# EAGLE design lanternLED (EAGLE 8.6.3)
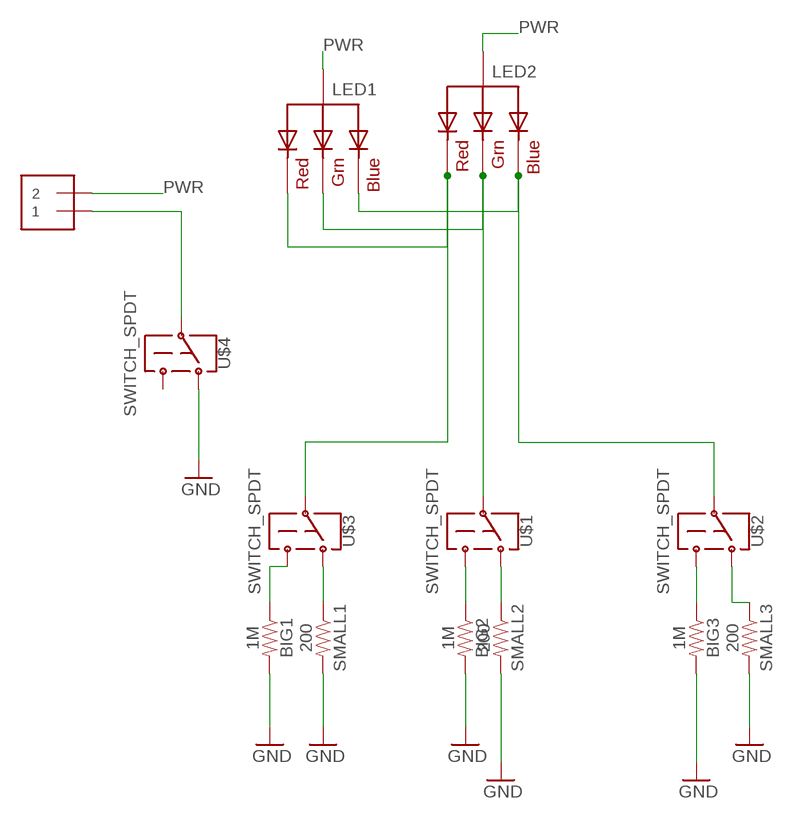
[diagram p0: schematic, sheet 1]

## Parts
BIG1  1M  10KOHM-0603-1/10W-1%  [0603]
BIG2  1M  10KOHM-0603-1/10W-1%  [0603]
BIG3  1M  10KOHM-0603-1/10W-1%  [0603]
J1  1X2BIGGERHOLES  [1X2-4.5MM]
LED1  RGBLED_CA-PIRANHA  [PIRANHA5MM]
LED2  RGBLED_CA-PIRANHA  [PIRANHA5MM]
SMALL1  200  4.7KOHM-0603-1/10W-1%  [0603]
SMALL2  200  4.7KOHM-0603-1/10W-1%  [0603]
SMALL3  200  4.7KOHM-0603-1/10W-1%  [0603]
U$1  SWITCH_SPDT  [SWITCH_SPDT_SMD_CLSB12B]
U$2  SWITCH_SPDT  [SWITCH_SPDT_SMD_CLSB12B]
U$3  SWITCH_SPDT  [SWITCH_SPDT_SMD_CLSB12B]
U$4  SWITCH_SPDT  [SWITCH_SPDT_SMD_CLSB12B]

## Nets
GND: BIG1.2 BIG2.2 BIG3.2 SMALL1.2 SMALL2.2 SMALL3.2 U$4.SIDER
N$1: LED1.2(RED) LED2.2(RED) U$3.TOP(SINGLE)
N$2: LED1.3(GREEN) LED2.3(GREEN) U$1.TOP(SINGLE)
N$3: LED1.1(BLUE) LED2.1(BLUE) U$2.TOP(SINGLE)
N$4: BIG1.1 U$3.SIDEL
N$5: SMALL1.1 U$3.SIDER
N$6: BIG2.1 U$1.SIDEL
N$7: SMALL2.1 U$1.SIDER
N$8: BIG3.1 U$2.SIDEL
N$9: SMALL3.1 U$2.SIDER
N$11: J1.1 U$4.TOP(SINGLE)
PWR: J1.2 LED1.4(VCC) LED2.4(VCC)
Unconnected: U$4.SIDEL

## Library data of the parts
BIG1-BIG3 = SparkFun-Resistors:10KOHM: 10kΩ resistor A resistor is a passive two-terminal electrical component that implements electrical resistance as a circuit element. Resistors act to reduce current flow, and, at the same time, act to lower voltage levels within circuits. - Wikipedia; PROD_ID: RES-00824; VALUE: 10k
J1 = adafruit:1X2: 3.5mm Terminal block http://www.ladyada.net/library/pcb/eaglelibrary.html
LED1 LED2 = adafruit:RGBLED_CA: RGB LED, common-anode 5MM Staggered pins 5mm Piranha package http://www.ladyada.net/library/pcb/eaglelibrary.html
SMALL1-SMALL3 = SparkFun-Resistors:4.7KOHM: 4.7kΩ resistor A resistor is a passive two-terminal electrical component that implements electrical resistance as a circuit element. Resistors act to reduce current flow, and, at the same time, act to lower voltage levels within circuits. - Wikipedia; PROD_ID: RES-07857; VALUE: 4.7k
U$1-U$4 = trellisLaura:SWITCH_SPDT: SPDT switch https://www.digikey.com/product-detail/en/nidec-copal-electronics/CL-SB-12B-01T/563-1318-1-ND/3507878 CL-SB-12B-01T Laura June 2018

## Net classes
0 default: width 0.305 mm, drill 0.508 mm, clearance 0.254 mm

## Board
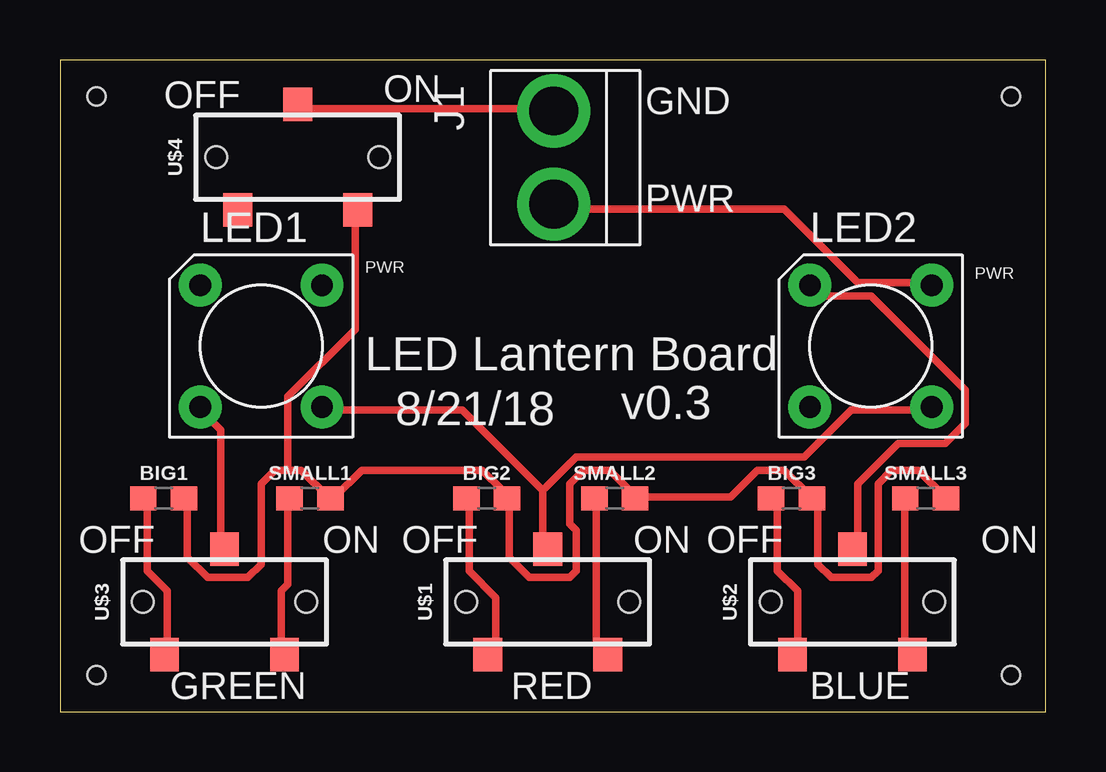
[diagram p1: board, top side]
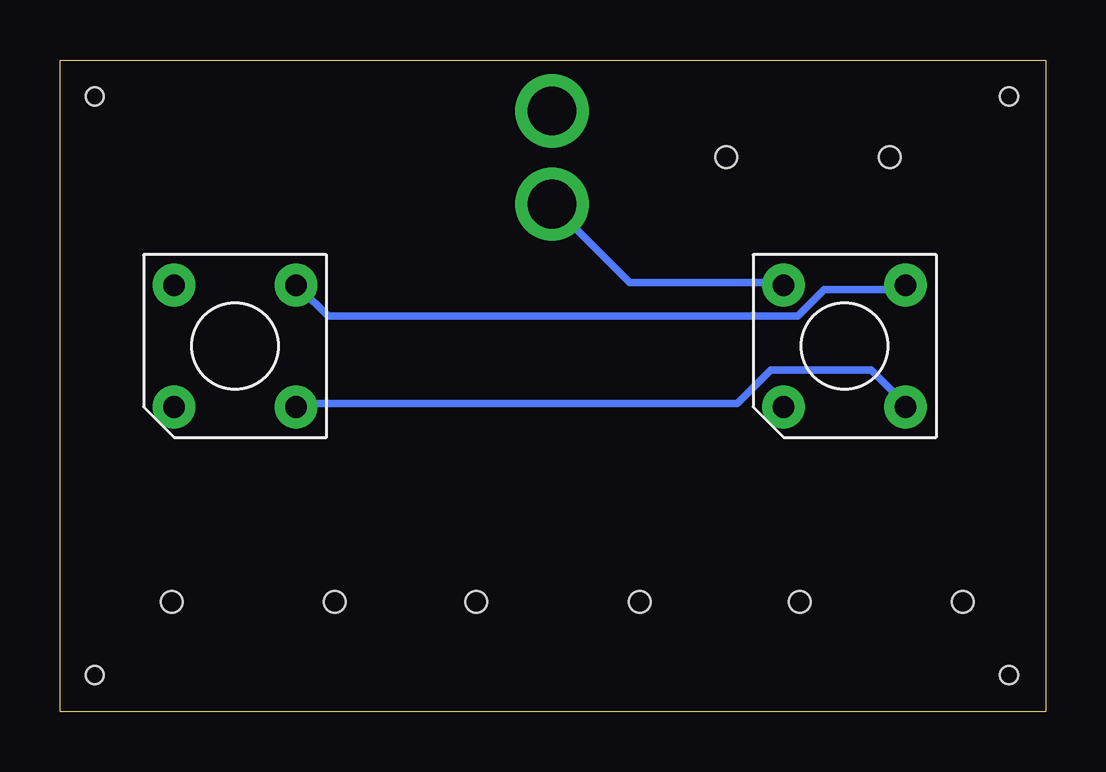
[diagram p2: board, bottom side, seen from below]

Size 41.07 x 27.17 mm. Coordinates in mm from the lower left corner, seen from the top.
Outline: 0,0 41.07,0 41.07,27.17 0,27.17 0,0
Copper layers (1*16): Top 0.035559375mm / dielectric 1.6mm / Bottom 0.035559375mm
Design rules "oshpark-2layer": minimum track width 6mil, minimum drill 10mil, track to track 6mil, track to pad 6mil, pad to pad 6mil, via to via 6mil, smd to smd 6mil, copper to edge 15mil, drill to drill 6mil, minimum pad ring 5mil, minimum via ring 5mil, stop-mask expansion 2.5mil, vias tented up to drill 0mil, thermal gap 10mil
Holes 0.75 mm at 1.52,25.65 39.62,25.65 39.62,1.52 1.52,1.52

### Footprints (pad centres in the part's own frame; a part is rotated, then mirrored left to right if it is on the bottom)
0603 = smd 1.1 x 1: 1 -0.85,0; 2 0.85,0
1X2-4.5MM = drill 2.032 pad 2.794: 1 1.927,0; 2 -1.954,0
PIRANHA5MM = drill 0.9 pad 1.778: 1 -2.54,2.54; 2 -2.54,-2.54; 3 2.54,-2.54; 4 2.54,2.54
SWITCH_SPDT_SMD_CLSB12B = smd 1.2 x 1.4: SIDEL -2.5,-2.2; SIDER 2.5,-2.2; TOP 0,2.2 | hole 0.9: 3.4,0; -3.4,0

### Placement (x,y rotation side)
BIG1  4.32,8.89 0 top
BIG2  17.78,8.89 0 top
BIG3  30.48,8.89 0 top
J1  20.57,23.11 90 top
LED1  8.38,15.24 0 top
LED2  33.78,15.24 0 top
SMALL1  10.41,8.89 0 top
SMALL2  23.11,8.89 0 top
SMALL3  36.07,8.89 0 top
U$1  20.32,4.57 0 top
U$2  33.02,4.57 0 top
U$3  6.86,4.57 0 top
U$4  9.91,23.11 0 top

### Tracks (layer width: path | path; a pad name or v marks a point on that pad's centre or on a via)
GND
  Top 0.305: SMALL3.2 36.88,8.94 35.76,10.06 34.65,10.06 34.09,9.5 34.09,5.87 33.81,5.59 32.13,5.59 31.57,6.15 31.57,8.66 BIG3.2 31.29,8.94 30.18,10.06 29.06,10.06 27.94,8.94 24.03,8.94 SMALL2.2 23.75,8.94 23.75,9.22 22.91,10.06 21.79,10.06 21.23,9.5 21.23,7.82 21.51,7.54 21.51,5.87 21.23,5.59 19.56,5.59 18.72,6.43 18.72,8.66 BIG2.2 18.44,8.94 18.44,9.22 17.6,10.06 12.57,10.06 11.46,8.94 SMALL1.2 11.18,8.94 10.06,10.06 9.5,10.06 | 9.5,10.06 8.94,10.06 8.38,9.5 8.38,6.15 7.82,5.59 6.15,5.59 5.31,6.43 5.31,8.66 BIG1.2 | 9.5,10.06 9.5,13.13 12.29,15.93 12.29,20.68 U$4.SIDER
N$1
  Top 0.305: U$3.TOP 6.71,6.99 6.71,11.73 5.87,12.57 LED1.2
  Bottom 0.305: LED2.2 31.01,12.85 12.85,12.85 11.46,14.25 7.26,14.25 5.87,12.85 LED1.2
N$2
  Top 0.305: 20.12,9.22 20.12,6.99 U$1.TOP | 20.12,9.22 16.76,12.57 11.18,12.57 LED1.3 | 20.12,9.22 21.51,10.62 31.01,10.62 32.97,12.57 36.32,12.57 LED2.3
N$3
  Top 0.305: U$2.TOP 33.25,6.99 33.25,9.5 34.92,11.18 36.88,11.18 37.72,12.01 37.72,13.41 33.81,17.32 31.57,17.32 31.29,17.6 LED2.1
  Bottom 0.305: LED1.1 5.87,17.6 9.22,17.6 10.34,16.48 29.9,16.48 31.01,17.6 LED2.1
N$4
  Top 0.305: BIG1.1 3.63,8.66 3.63,5.87 4.47,5.03 4.47,2.52 U$3.SIDEL
N$5
  Top 0.305: SMALL1.1 9.5,8.66 9.5,5.31 9.22,5.03 9.22,2.52 U$3.SIDER
N$6
  Top 0.305: BIG2.1 17.04,8.66 17.04,5.87 18.16,4.75 18.16,2.79 17.88,2.52 U$1.SIDEL
N$7
  Top 0.305: SMALL2.1 22.35,8.66 22.35,2.79 22.63,2.52 U$1.SIDER
N$8
  Top 0.305: BIG3.1 29.9,8.66 29.9,5.87 30.73,5.03 30.73,2.52 U$2.SIDEL
N$9
  Top 0.305: SMALL3.1 35.2,8.66 35.2,2.79 35.48,2.52 U$2.SIDER
N$11
  Top 0.305: U$4.TOP 10.06,25.15 20.4,25.15 J1.1
PWR
  Top 0.305: LED2.4 36.32,17.88 33.25,17.88 30.18,20.95 20.68,20.95 J1.2
  Bottom 0.305: LED1.4 11.18,17.88 17.32,17.88 20.4,20.95 J1.2

### Text on the board
tPlace: OFF | ON | GND | PWR | PWR | PWR | LED Lantern Board | 8/21/18 | v0.3 | OFF | ON | OFF | ON | OFF | ON | GREEN | RED | BLUE